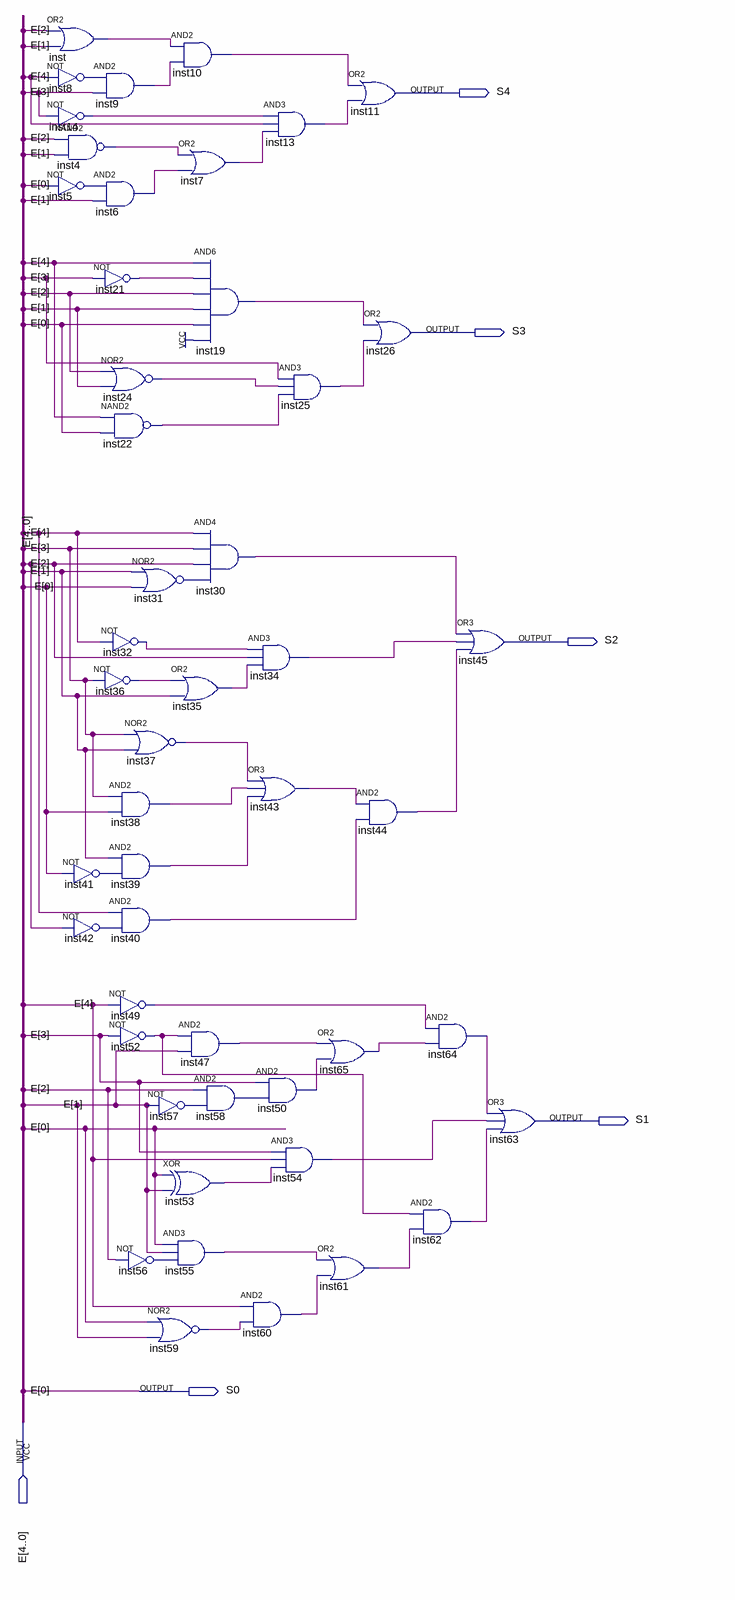
[diagram p0: schematic sheet]
// Quartus schematic FiveBitToBcd.bdf as structural Verilog: 49 symbols, 6 pins
module FiveBitToBcd (
  input  [4:0] E,
  output S4,
  output S3,
  output S2,
  output S1,
  output S0
);

  wire inst4_out, inst5_out, inst6_out, inst7_out, inst8_out, inst9_out, inst10_out, inst13_out, inst14_out,
       inst19_out, inst21_out, inst22_out, inst24_out, inst25_out, inst30_out, inst31_out, inst32_out,
       inst34_out, inst35_out, inst36_out, inst37_out, inst38_out, inst39_out, inst40_out, inst41_out,
       inst42_out, inst43_out, inst44_out, inst47_out, inst49_out, inst50_out, inst52_out, inst53_out,
       inst54_out, inst55_out, inst56_out, inst57_out, inst58_out, inst59_out, inst60_out, inst61_out,
       inst62_out, inst64_out, inst65_out, inst_out;

  or inst (inst_out, E[2], E[1]);
  not inst8 (inst8_out, E[4]);
  not inst14 (inst14_out, E[3]);
  nand inst4 (inst4_out, E[2], E[1]);
  not inst5 (inst5_out, E[0]);
  not inst41 (inst41_out, E[0]);
  not inst42 (inst42_out, E[2]);
  and inst9 (inst9_out, inst8_out, E[3]);
  and inst6 (inst6_out, inst5_out, E[1]);
  not inst21 (inst21_out, E[3]);
  nor inst24 (inst24_out, E[2], E[1]);
  nand inst22 (inst22_out, E[4], E[0]);
  nor inst31 (inst31_out, E[1], E[0]);
  not inst32 (inst32_out, E[4]);
  not inst36 (inst36_out, E[3]);
  nor inst37 (inst37_out, E[3], E[1]);
  and inst38 (inst38_out, E[3], E[0]);
  and inst39 (inst39_out, E[1], inst41_out);
  and inst40 (inst40_out, E[4], inst42_out);
  not inst49 (inst49_out, E[4]);
  not inst52 (inst52_out, E[3]);
  not inst56 (inst56_out, E[2]);
  and inst10 (inst10_out, inst_out, inst9_out);
  or inst7 (inst7_out, inst4_out, inst6_out);
  and inst19 (inst19_out, E[4], inst21_out, E[2], E[1], E[0], 1'b1);
  and inst30 (inst30_out, E[4], E[3], E[2], inst31_out);
  or inst35 (inst35_out, inst36_out, E[1]);
  and inst47 (inst47_out, inst52_out, E[1]);
  and inst58 (inst58_out, E[2], inst57_out);
  not inst57 (inst57_out, E[1]);
  xor inst53 (inst53_out, E[0], E[1]);
  and inst55 (inst55_out, E[0], E[1], inst56_out);
  nor inst59 (inst59_out, E[0], E[1]);
  and inst34 (inst34_out, inst32_out, E[2], inst35_out);
  or inst43 (inst43_out, inst37_out, inst38_out, inst39_out);
  and inst50 (inst50_out, E[3], inst58_out);
  and inst60 (inst60_out, E[4], inst59_out);
  and inst13 (inst13_out, inst14_out, E[4], inst7_out);
  and inst25 (inst25_out, E[3], inst24_out, inst22_out);
  or inst65 (inst65_out, inst47_out, inst50_out);
  and inst54 (inst54_out, E[3], E[4], inst53_out);
  or inst61 (inst61_out, inst55_out, inst60_out);
  or inst11 (S4, inst10_out, inst13_out);
  or inst26 (S3, inst19_out, inst25_out);
  and inst44 (inst44_out, inst43_out, inst40_out);
  and inst64 (inst64_out, inst49_out, inst65_out);
  and inst62 (inst62_out, inst52_out, inst61_out);
  or inst45 (S2, inst30_out, inst34_out, inst44_out);
  or inst63 (S1, inst64_out, inst54_out, inst62_out);

  assign S0 = E[0];
endmodule
